# EAGLE schematic OLM-1.0.1 (EAGLE 6.4)
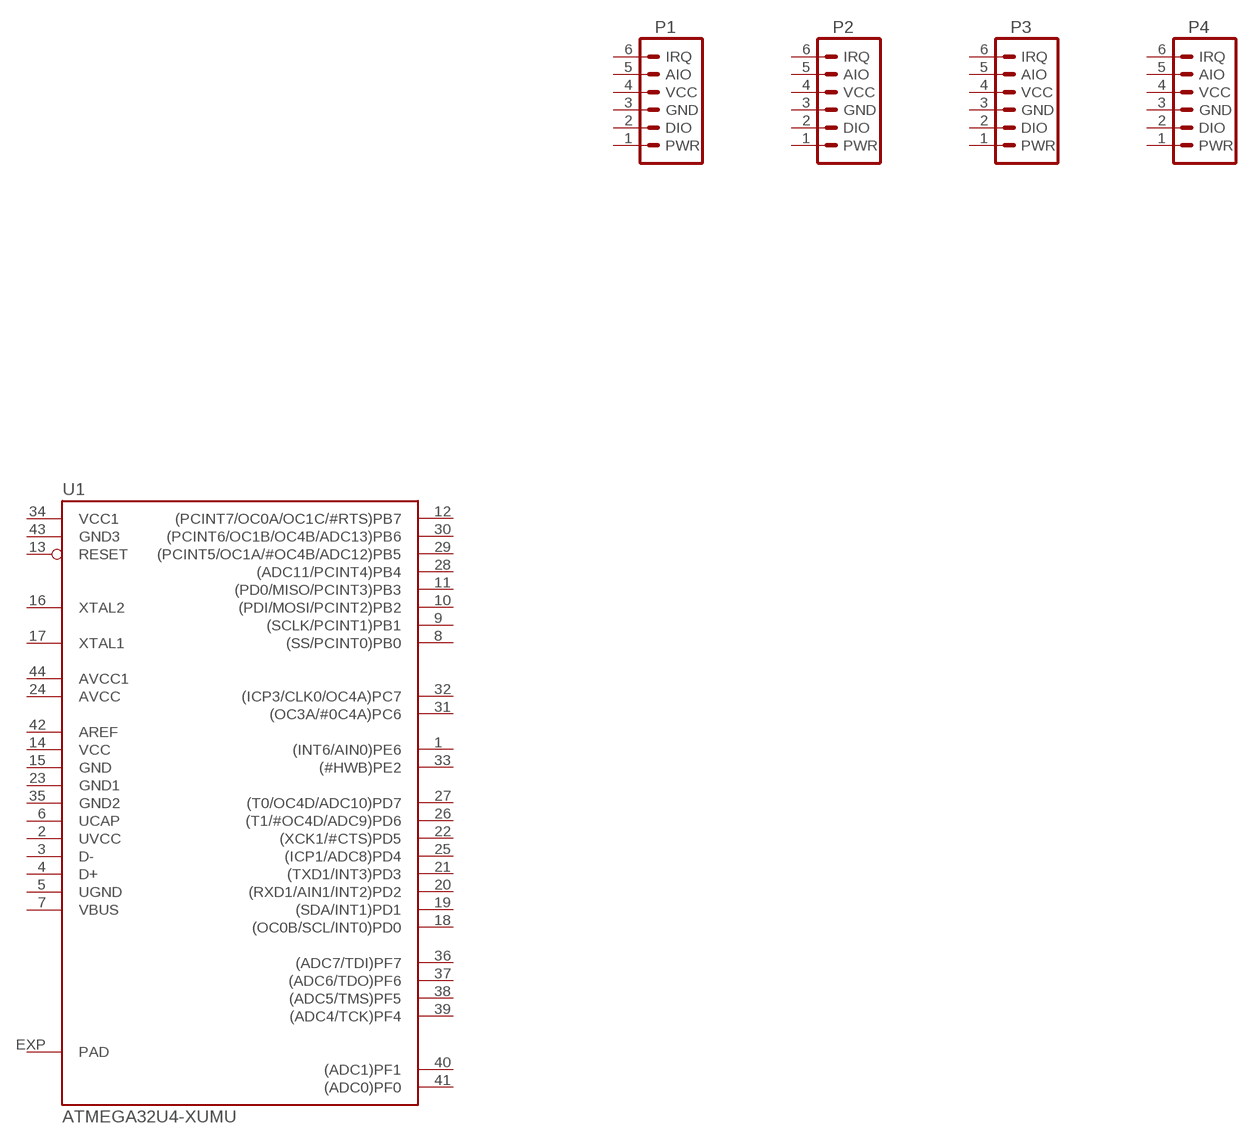
[diagram p0: schematic, sheet 1]

## Parts
P1  JEEPORT  JEEPORT-FEMALE  [1X06_FEMALE_LOCK.010]
P2  JEEPORT  JEEPORT-FEMALE  [1X06_FEMALE_LOCK.010]
P3  JEEPORT  JEEPORT-FEMALE  [1X06_FEMALE_LOCK.010]
P4  JEEPORT  JEEPORT-FEMALE  [1X06_FEMALE_LOCK.010]
U1  ATMEGA32U4-XUMU  [QFN44ML7X7]
Unconnected: P1.2(DIO) P1.5(AIO) P1.6(IRQ) P2.2(DIO) P2.5(AIO) P2.6(IRQ) P3.2(DIO) P3.5(AIO) P3.6(IRQ) P4.2(DIO) P4.5(AIO) P4.6(IRQ) U1.1((INT6/AIN0)PE6) U1.3(D-) U1.4(D+) U1.6(UCAP) U1.7(VBUS) U1.8((SS/PCINT0)PB0) U1.9((SCLK/PCINT1)PB1) U1.10((PDI/MOSI/PCINT2)PB2) U1.11((PD0/MISO/PCINT3)PB3) U1.12((PCINT7/OC0A/OC1C/#RTS)PB7) U1.13(RESET) U1.16(XTAL2) U1.17(XTAL1) U1.18((OC0B/SCL/INT0)PD0) U1.19((SDA/INT1)PD1) U1.20((RXD1/AIN1/INT2)PD2) U1.21((TXD1/INT3)PD3) U1.22((XCK1/#CTS)PD5) U1.25((ICP1/ADC8)PD4) U1.26((T1/#OC4D/ADC9)PD6) U1.27((T0/OC4D/ADC10)PD7) U1.28((ADC11/PCINT4)PB4) U1.29((PCINT5/OC1A/#OC4B/ADC12)PB5) U1.30((PCINT6/OC1B/OC4B/ADC13)PB6) U1.31((OC3A/#0C4A)PC6) U1.32((ICP3/CLK0/OC4A)PC7) U1.33((#HWB)PE2) U1.36((ADC7/TDI)PF7) U1.37((ADC6/TDO)PF6) U1.38((ADC5/TMS)PF5) U1.39((ADC4/TCK)PF4) U1.40((ADC1)PF1) U1.41((ADC0)PF0)

## Power pins joined to a net without a drawn wire
AREF: U1.42(AREF)
AVCC: U1.24(AVCC)
AVCC1: U1.44(AVCC1)
GND: P1.3(GND) P2.3(GND) P3.3(GND) P4.3(GND) U1.15(GND)
GND1: U1.23(GND1)
GND2: U1.35(GND2)
GND3: U1.43(GND3)
PAD: U1.EXP(PAD)
PWR: P1.1(PWR) P2.1(PWR) P3.1(PWR) P4.1(PWR)
UGND: U1.5(UGND)
UVCC: U1.2(UVCC)
VCC: P1.4(VCC) P2.4(VCC) P3.4(VCC) P4.4(VCC) U1.14(VCC)
VCC1: U1.34(VCC1)

## Library data of the parts
P1-P4 = JeeLabs:JEEPORT: PIN HEADER
U1 = SmartPrj:ATMEGA32U4-XU

## Net classes
1 power: width 0.406 mm
2 gnd: width 0.254 mm, drill 0.61 mm, clearance 0.254 mm
3 usbvcc: width 0.254 mm, drill 0.61 mm, clearance 0.254 mm
4 aref: width 0.254 mm, drill 0.61 mm, clearance 0.254 mm